# Altium schematic sheet Aux_Lights_Daughter_REV3.SchDoc
size A; SheetNumber: 2; SheetTotal: 2
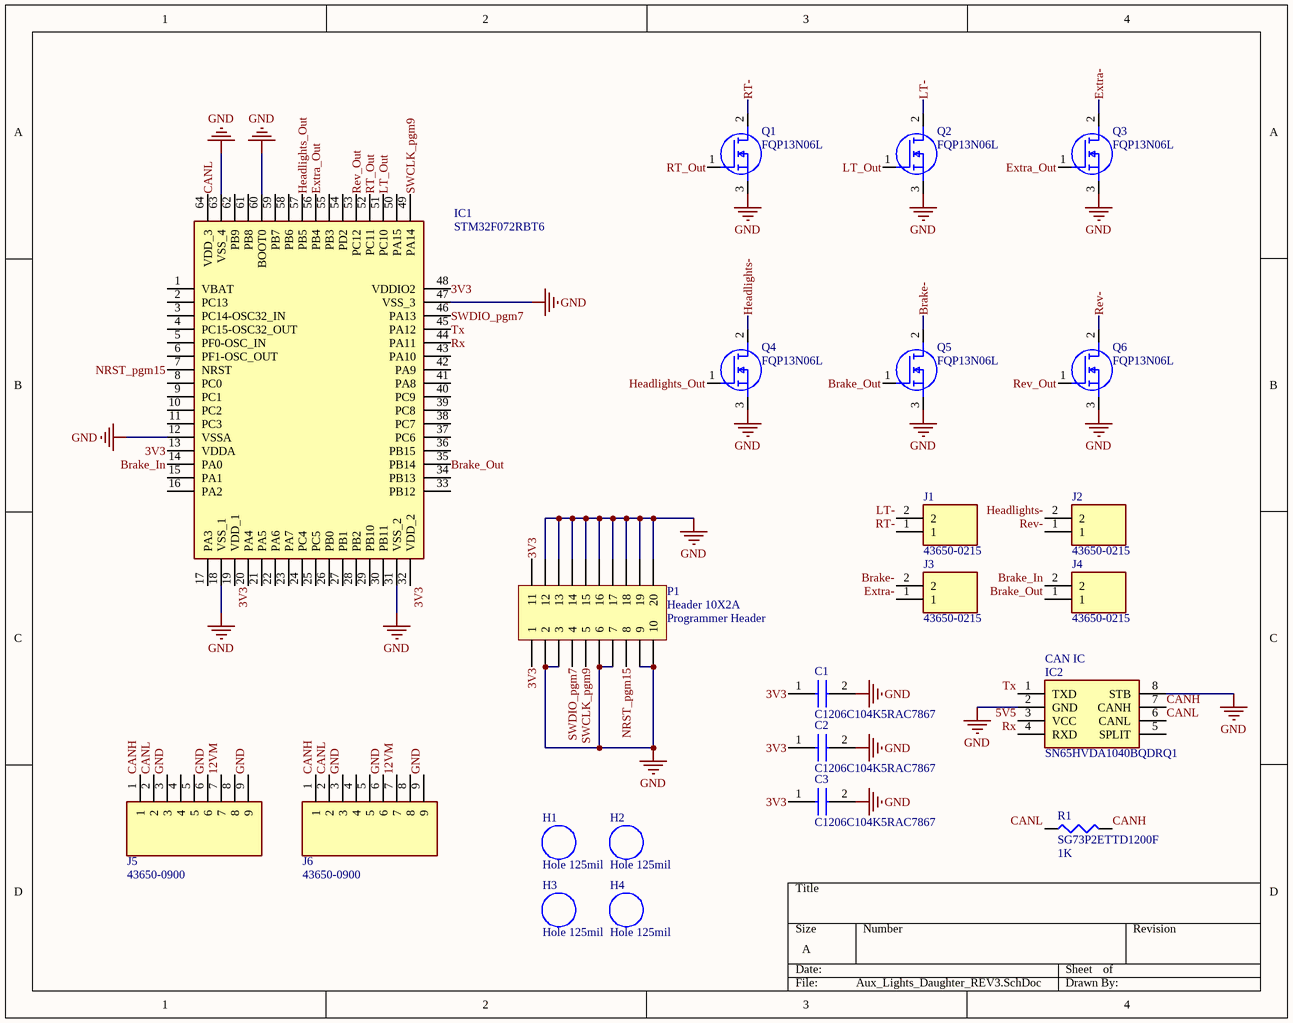
[diagram p0: Aux_Lights_Daughter_REV3.SchDoc]

## Parts
C1  C1206C104K5RAC7867  [CAPC3216X110N]
C2  C1206C104K5RAC7867  [CAPC3216X110N]
C3  C1206C104K5RAC7867  [CAPC3216X110N]
H1  Hole 125mil  [Hole]
H2  Hole 125mil  [Hole]
H3  Hole 125mil  [Hole]
H4  Hole 125mil  [Hole]
IC1  STM32F072RBT6  [QFP50P1200X1200X160-64N]
IC2  SN65HVDA1040BQDRQ1  [SOIC127P600X175-8N]
J1  43650-0215  [43650-02YY_15,16,17]
J2  43650-0215  [43650-02YY_15,16,17]
J3  43650-0215  [43650-02YY_15,16,17]
J4  43650-0215  [43650-02YY_15,16,17]
J5  43650-0900  [43650-09YY_R]
J6  43650-0900  [43650-09YY_R]
P1  Header 10X2A  [HDR2X10_CEN]
Q1  FQP13N06L  [TO254P483X1016X2261-3P]
Q2  FQP13N06L  [TO254P483X1016X2261-3P]
Q3  FQP13N06L  [TO254P483X1016X2261-3P]
Q4  FQP13N06L  [TO254P483X1016X2261-3P]
Q5  FQP13N06L  [TO254P483X1016X2261-3P]
Q6  FQP13N06L  [TO254P483X1016X2261-3P]
R1  SG73P2ETTD1200F  value 1K  [14-1210]

## Nets
GND: C1.2 C2.2 C3.2 IC1.12(VSSA) IC1.18(VSS_1) IC1.31(VSS_2) IC1.47(VSS_3) IC1.60(BOOT0) IC1.63(VSS_4) IC2.2(GND) IC2.8(STB) J5.3 J5.6 J5.9 J6.3 J6.6 J6.9 P1.2 P1.3 P1.6 P1.7 P1.9 P1.10 P1.12 P1.13 P1.14 P1.15 P1.16 P1.17 P1.18 P1.19 P1.20 Q1.3(S) Q2.3(S) Q3.3(S) Q4.3(S) Q5.3(S) Q6.3(S)
3V3: C1.1 C2.1 C3.1 IC1.13(VDDA) IC1.19(VDD_1) IC1.32(VDD_2) IC1.48(VDDIO2) P1.1 P1.11
5V5: IC2.3(VCC)
12VM: J5.7 J6.7
Brake-: J3.2 Q5.2(D)
Brake_In: IC1.14(PA0) J4.2
Brake_Out: IC1.35(PB14) J4.1 Q5.1(G)
CANH: IC2.7(CANH) J5.1 J6.1 R1.2
CANL: IC1.64(VDD_3) IC2.6(CANL) J5.2 J6.2 R1.1
Extra-: J3.1 Q3.2(D)
Extra_Out: IC1.56(PB4) Q3.1(G)
Headlights-: J2.2 Q4.2(D)
Headlights_Out: IC1.57(PB5) Q4.1(G)
LT-: J1.2 Q2.2(D)
LT_Out: IC1.51(PC10) Q2.1(G)
NRST_pgm15: IC1.7(NRST) P1.8
Rev-: J2.1 Q6.2(D)
Rev_Out: IC1.53(PC12) Q6.1(G)
RT-: J1.1 Q1.2(D)
RT_Out: IC1.52(PC11) Q1.1(G)
Rx: IC1.44(PA11) IC2.4(RXD)
SWCLK_pgm9: IC1.49(PA14) P1.5
SWDIO_pgm7: IC1.46(PA13) P1.4
Tx: IC1.45(PA12) IC2.1(TXD)

Not connected (* = marked no-connect by the designer): IC1 1(VBAT) 2(PC13) 3(PC14-OSC32_IN) 4(PC15-OSC32_OUT) 5(PF0-OSC_IN) 6(PF1-OSC_OUT) 8(PC0) 9(PC1) 10(PC2) 11(PC3) 15(PA1) 16(PA2) 17(PA3) 20(PA4) 21(PA5) 22(PA6) 23(PA7) 24(PC4) 25(PC5) 26(PB0) 27(PB1) 28(PB2) 29(PB10) 30(PB11) 33(PB12) 34(PB13) 36(PB15) 37(PC6) 38(PC7) 39(PC8) 40(PC9) 41(PA8) 42(PA9) 43(PA10) 50(PA15) 54(PD2) 55(PB3) 58(PB6) 59(PB7) 61(PB8) 62(PB9); IC2 5(SPLIT); J5 4 5 8; J6 4 5 8

## Notes on the sheet
- (near P1) Programmer Header
- (near IC2) CAN IC

## Library data of the parts
C1-C3 = C1206C104K5RAC7867: Capacitor; Manufacturer_Name: Kemet; Datasheet Link: https://componentsearchengine.com//C1206C104K5RAC7867.pdf; Height: 1.1mm; Mouser2 Part Number: 80-C1206104K5RAC7867; Mouser2 Price/Stock: https://www.mouser.com/Search/Refine.aspx?Keyword=80-C1206104K5RAC7867; Manufacturer_Part_Number: C1206C104K5RAC7867
IC1 = STM32F072RBT6: Integrated Circuit; Manufacturer_Name: STMicroelectronics; Datasheet Link: https://componentsearchengine.com//STM32F072RBT6.pdf; Height: 1.6mm; Mouser2 Part Number: 511-STM32F072RBT6; Mouser2 Price/Stock: https://www.mouser.com/Search/Refine.aspx?Keyword=511-STM32F072RBT6; Manufacturer_Part_Number: STM32F072RBT6
IC2 = SN65HVDA1040BQDRQ1: Integrated Circuit; Manufacturer_Name: Texas Instruments; Datasheet Link: http://www.ti.com/lit/gpn/SN65HVDA1040B-Q1; Height: 1.75mm; Manufacturer_Part_Number: SN65HVDA1040BQDRQ1
J1-J4 = 43650-0215: Connector; Manufacturer_Name: Molex; Datasheet Link: https://componentsearchengine.com//43650-0215.pdf; Height: 9.9mm; Mouser2 Part Number: 538-43650-0215; Mouser2 Price/Stock: https://www.mouser.com/Search/Refine.aspx?Keyword=538-43650-0215; Manufacturer_Part_Number: 43650-0215
J5 J6 = 43650-0900: Connector; Manufacturer_Name: Molex; Datasheet Link: https://www.molex.com/pdm_docs/sd/436500200_sd.pdf; Height: 5.57mm; Manufacturer_Part_Number: 43650-0900
P1 = Header 10X2A: Header, 10-Pin, Dual row; LatestRevisionDate: 17-Jul-2002; LatestRevisionNote: Re-released for DXP Platform.; Publisher: Altium Limited
Q1-Q6 = FQP13N06L: MOSFET (N-Channel); Manufacturer_Name: ON Semiconductor; Datasheet Link: https://componentsearchengine.com//FQP13N06L.pdf; Height: 4.83mm; Mouser2 Part Number: 512-FQP13N06L; Mouser2 Price/Stock: https://www.mouser.com/Search/Refine.aspx?Keyword=512-FQP13N06L; Manufacturer_Part_Number: FQP13N06L
R1 = Res3: Resistor; Published: 8-Jun-2000; LatestRevisionDate: 29-May-2009; LatestRevisionNote: IPC-7351 Footprint Added.; PackageReference: J1-0603; Publisher: Altium Limited; PackageDescription: Chip Resistor